# Altium schematic sheet Sheet1.SchDoc
size A4
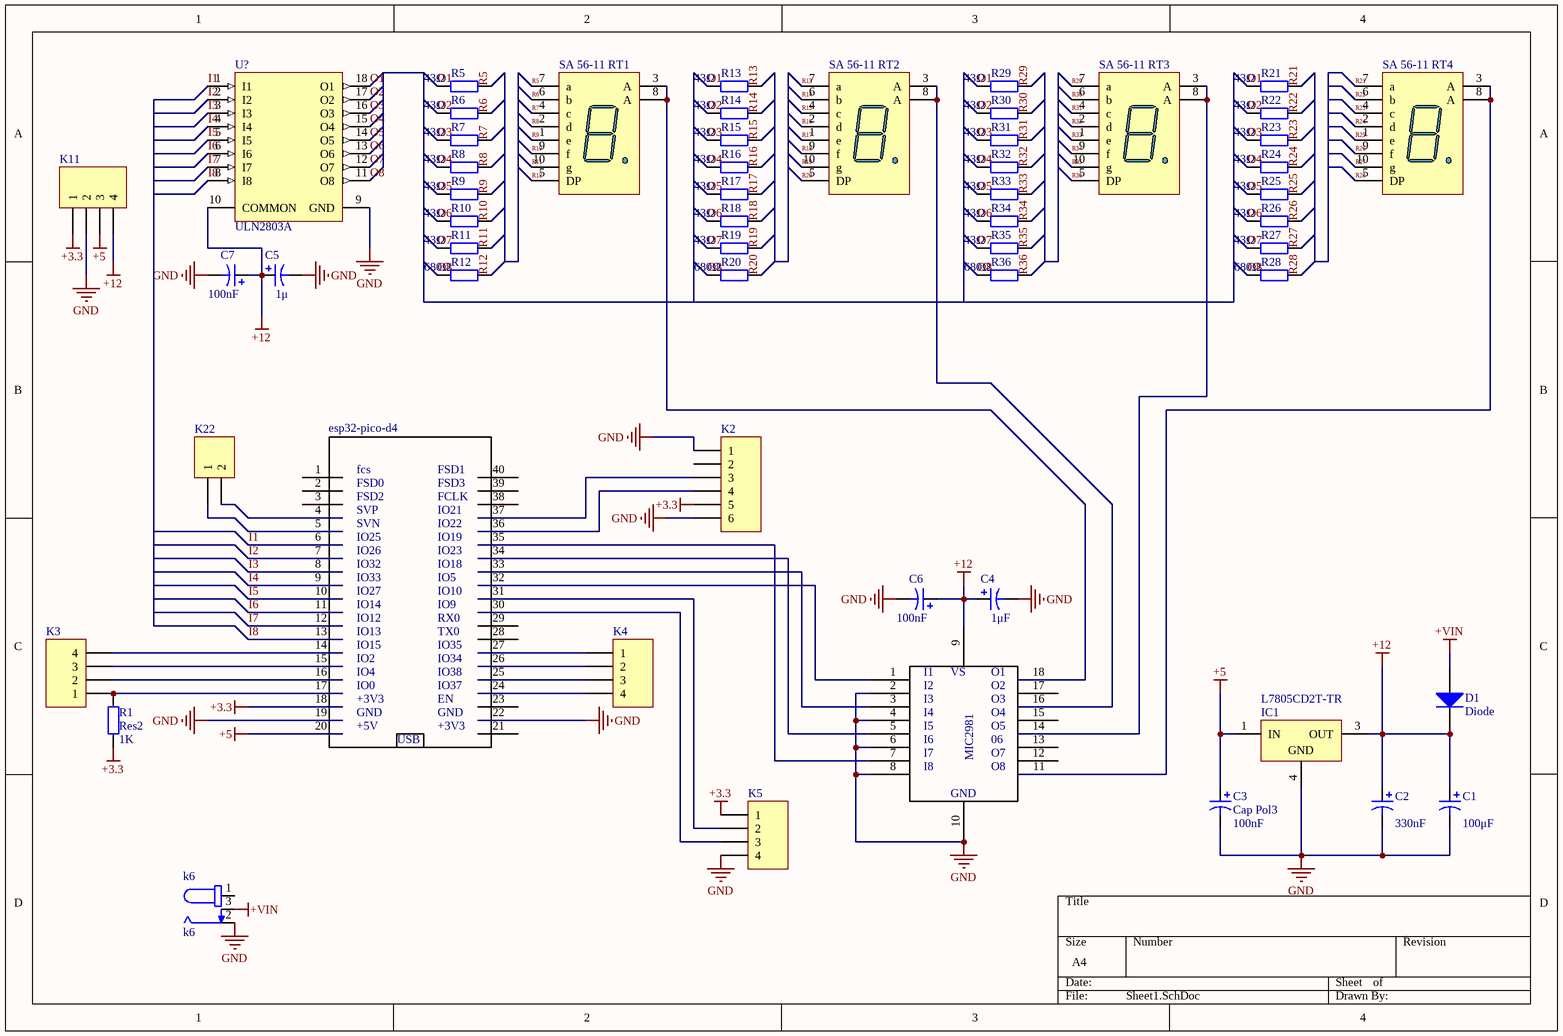
[diagram p0: Sheet1.SchDoc]

## Parts
C1  value 100μF  [CAPR5-4X5]  (hidden comment: Cap Pol1)
C2  value 330nF  [C0805]  (hidden comment: Cap Pol3)
C3  Cap Pol3  value 100nF  [C0805]
C4  value 1μF  [C0805]  (hidden comment: Cap Pol3)
C5  value 1μ  [C0805]  (hidden comment: Cap Pol3)
C6  value 100nF  [C0805]  (hidden comment: Cap Pol3)
C7  value 100nF  [C0805]  (hidden comment: Cap Pol3)
D1  Diode  [DO-41]
esp32-pico-d4  esp32-pico-d4  [esp32picod4]  (value not drawn)
IC1  L7805CD2T-TR  [TO-263_M]
K2  Header 6  [HDR1X6]  (value not drawn)
K3  Header 4  [HDR1X4]  (value not drawn)
K4  Header 4  [HDR1X4]  (value not drawn)
K5  Header 4  [HDR1X4]  (value not drawn)
k6  k6  [k6]
K11  Header 4  [HDR1X4]  (value not drawn)
K22  Header 2  [HDR1X2]  (value not drawn)
mic  MIC2981  [MIC2981]  (value not drawn)
R1  Res2  value 1K  [AXIAL-0.4]
R5  value 43Ω  [smd43]  (hidden comment: Res2)
R6  value 43Ω  [smd43]  (hidden comment: Res2)
R7  value 43Ω  [smd43]  (hidden comment: Res2)
R8  value 43Ω  [smd43]  (hidden comment: Res2)
R9  value 43Ω  [smd43]  (hidden comment: Res2)
R10  value 43Ω  [smd43]  (hidden comment: Res2)
R11  value 43Ω  [smd43]  (hidden comment: Res2)
R12  value 680Ω  [smd43]  (hidden comment: Res2)
R13  value 43Ω  [smd43]  (hidden comment: Res2)
R14  value 43Ω  [smd43]  (hidden comment: Res2)
R15  value 43Ω  [smd43]  (hidden comment: Res2)
R16  value 43Ω  [smd43]  (hidden comment: Res2)
R17  value 43Ω  [smd43]  (hidden comment: Res2)
R18  value 43Ω  [smd43]  (hidden comment: Res2)
R19  value 43Ω  [smd43]  (hidden comment: Res2)
R20  value 680Ω  [smd43]  (hidden comment: Res2)
R21  value 43Ω  [smd43]  (hidden comment: Res2)
R22  value 43Ω  [smd43]  (hidden comment: Res2)
R23  value 43Ω  [smd43]  (hidden comment: Res2)
R24  value 43Ω  [smd43]  (hidden comment: Res2)
R25  value 43Ω  [smd43]  (hidden comment: Res2)
R26  value 43Ω  [smd43]  (hidden comment: Res2)
R27  value 43Ω  [smd43]  (hidden comment: Res2)
R28  value 680Ω  [smd43]  (hidden comment: Res2)
R29  value 43Ω  [smd43]  (hidden comment: Res2)
R30  value 43Ω  [smd43]  (hidden comment: Res2)
R31  value 43Ω  [smd43]  (hidden comment: Res2)
R32  value 43Ω  [smd43]  (hidden comment: Res2)
R33  value 43Ω  [smd43]  (hidden comment: Res2)
R34  value 43Ω  [smd43]  (hidden comment: Res2)
R35  value 43Ω  [smd43]  (hidden comment: Res2)
R36  value 680Ω  [smd43]  (hidden comment: Res2)
SA_56-11_RT1  Dpy Blue-CA  [H]  (value not drawn)
SA_56-11_RT2  Dpy Blue-CA  [H]  (value not drawn)
SA_56-11_RT3  Dpy Blue-CA  [H]  (value not drawn)
SA_56-11_RT4  Dpy Blue-CA  [H]  (value not drawn)
U?  ULN2803A  [STM-DIP-18]

## Nets
+3.3: esp32-pico-d4.18 K2.5 K5.1 K11.1 R1.1
+5: C3.1 esp32-pico-d4.20 IC1.1(IN) K11.3
+12: C1.1 C2.1 C4.1 C5.1 C6.1 C7.1 D1.2(K) IC1.3(OUT) K11.4 U?.10(COMMON)
+VIN: D1.1(A) k6.3
GND: C1.2 C2.2 C3.2 C4.2 C5.2 C6.2 C7.2 esp32-pico-d4.19 esp32-pico-d4.22 IC1.4(GND) K2.1 K2.6 K5.4 k6.2 K11.2 mic.2 mic.4 mic.6 mic.8 mic.10 U?.9(GND)
I1: esp32-pico-d4.6 U?.1(I1)
I2: esp32-pico-d4.7 U?.2(I2)
I3: esp32-pico-d4.8 U?.3(I3)
I4: esp32-pico-d4.9 U?.4(I4)
I5: esp32-pico-d4.10 U?.5(I5)
I6: esp32-pico-d4.11 U?.6(I6)
I7: esp32-pico-d4.12 U?.7(I7)
I8: esp32-pico-d4.13 U?.8(I8)
O1: R5.1 R13.1 R21.1 R29.1 U?.18(O1)
O2: R6.1 R14.1 R22.1 R30.1 U?.17(O2)
O3: R7.1 R15.1 R23.1 R31.1 U?.16(O3)
O4: R8.1 R16.1 R24.1 R32.1 U?.15(O4)
O5: R9.1 R17.1 R25.1 R33.1 U?.14(O5)
O6: R10.1 R18.1 R26.1 R34.1 U?.13(O6)
O7: R11.1 R19.1 R27.1 R35.1 U?.12(O7)
O8: R12.1 R20.1 R28.1 R36.1 U?.11(O8)
R5: R5.2 SA_56-11_RT1.7(a)
R6: R6.2 SA_56-11_RT1.6(b)
R7: R7.2 SA_56-11_RT1.4(c)
R8: R8.2 SA_56-11_RT1.2(d)
R9: R9.2 SA_56-11_RT1.1(e)
R10: R10.2 SA_56-11_RT1.9(f)
R11: R11.2 SA_56-11_RT1.10(g)
R12: R12.2 SA_56-11_RT1.5(DP)
R13: R13.2 SA_56-11_RT2.7(a)
R14: R14.2 SA_56-11_RT2.6(b)
R15: R15.2 SA_56-11_RT2.4(c)
R16: R16.2 SA_56-11_RT2.2(d)
R17: R17.2 SA_56-11_RT2.1(e)
R18: R18.2 SA_56-11_RT2.9(f)
R19: R19.2 SA_56-11_RT2.10(g)
R20: R20.2 SA_56-11_RT2.5(DP)
R21: R21.2 SA_56-11_RT4.7(a)
R22: R22.2 SA_56-11_RT4.6(b)
R23: R23.2 SA_56-11_RT4.4(c)
R24: R24.2 SA_56-11_RT4.2(d)
R25: R25.2 SA_56-11_RT4.1(e)
R26: R26.2 SA_56-11_RT4.9(f)
R27: R27.2 SA_56-11_RT4.10(g)
R28: R28.2 SA_56-11_RT4.5(DP)
R29: R29.2 SA_56-11_RT3.7(a)
R30: R30.2 SA_56-11_RT3.6(b)
R31: R31.2 SA_56-11_RT3.4(c)
R32: R32.2 SA_56-11_RT3.2(d)
R33: R33.2 SA_56-11_RT3.1(e)
R34: R34.2 SA_56-11_RT3.9(f)
R35: R35.2 SA_56-11_RT3.10(g)
R36: R36.2 SA_56-11_RT3.5(DP)
Netesp32-pico-d4_4: esp32-pico-d4.4 K22.2
Netesp32-pico-d4_5: esp32-pico-d4.5 K22.1
Netesp32-pico-d4_14: esp32-pico-d4.14 K3.4
Netesp32-pico-d4_15: esp32-pico-d4.15 K3.3
Netesp32-pico-d4_16: esp32-pico-d4.16 K3.2
Netesp32-pico-d4_17: esp32-pico-d4.17 K3.1 R1.2
Netesp32-pico-d4_24: esp32-pico-d4.24 K4.4
Netesp32-pico-d4_25: esp32-pico-d4.25 K4.3
Netesp32-pico-d4_26: esp32-pico-d4.26 K4.2
Netesp32-pico-d4_27: esp32-pico-d4.27 K4.1
Netesp32-pico-d4_30: esp32-pico-d4.30 K5.3
Netesp32-pico-d4_31: esp32-pico-d4.31 K5.2
Netesp32-pico-d4_32: esp32-pico-d4.32 mic.1
Netesp32-pico-d4_33: esp32-pico-d4.33 mic.3
Netesp32-pico-d4_34: esp32-pico-d4.34 mic.5
Netesp32-pico-d4_35: esp32-pico-d4.35 mic.7
Netesp32-pico-d4_36: esp32-pico-d4.36 K2.4
Netesp32-pico-d4_37: esp32-pico-d4.37 K2.3
Netmic_11: mic.11 SA_56-11_RT4.3(A) SA_56-11_RT4.8(A)
Netmic_14: mic.14 SA_56-11_RT3.3(A) SA_56-11_RT3.8(A)
Netmic_16: mic.16 SA_56-11_RT2.3(A) SA_56-11_RT2.8(A)
Netmic_18: mic.18 SA_56-11_RT1.3(A) SA_56-11_RT1.8(A)

Not connected (* = marked no-connect by the designer): esp32-pico-d4 1 2 3 21 23 28 29 38 39 40; K2 2; k6 1; mic 9 12 13 15 17

## Notes on the sheet
- (in symbol MIC2981) I1; VS; O1; I2; O2; I3; O3; I4; O4; I5; O5; I6; 06; I7; O7; I8; O8; GND
- (in symbol picoESP32-PICO-KIT V) fcs; FSD1; FSD0; FSD3; FSD2; FCLK; SVP; IO21; SVN; IO22; IO25; IO19; IO26; IO23; IO32; IO18; IO33; IO5; IO27; IO10; IO14; IO9; IO12; RX0; IO13; TX0; IO15; IO35; IO2; IO34; IO4; IO38; IO0; IO37; +3V3; EN; GND; +5V; USB

## Library data of the parts
C1 = Cap Pol1: Polarized Capacitor (Radial); Published: 8-Jun-2000; LatestRevisionDate: 17-Jul-2002; LatestRevisionNote: Re-released for DXP Platform.; PackageReference: RB7.6-15; Publisher: Altium Limited; PackageDescription: Polarized Capacitor (Radial); 2 Leads
C2-C7 = Cap Pol3: Polarized Capacitor (Surface Mount); Published: 8-Jun-2000; LatestRevisionDate: 29-May-2009; LatestRevisionNote: IPC-7351 Footprint Added.; PackageReference: C0805; Publisher: Altium Limited; PackageDescription: Chip Capacitor
D1 = Diode 1N4002: 1 Amp General Purpose Rectifier; Published: 8-Jun-2000; LatestRevisionDate: 17-Jul-2002; LatestRevisionNote: Re-released for DXP Platform.; DatasheetVersion: 1998; PackageVersion: Aug-1999; PackageReference: DO-41; Publisher: Altium Limited; PackageDescription: Diode, Axial; Body 5.2 x 2.7 mm (LxDia. max), Lead Dia. 0.86 mm (max); Code_JEDEC: DO-204-AL; ComponentLink1Description: Manufacturer Link; ComponentLink1URL: http://www.fairchildsemi.com/; ComponentLink2Description: Datasheet; ComponentLink2URL: http://www.fairchildsemi.com/ds/1N%2F1N4001.pdf
esp32-pico-d4 = picoESP32-PICO-KIT V
IC1 = CMP-0244-00213-1: Positive Voltage Regulator, 3-Pin D2PAK, Tape and Reel; PackageReference: TO-263; ComponentLink2URL: http://www.st.com/internet/com/TECHNICAL_RESOURCES/TECHNICAL_LITERATURE/DATASHEET/CD00000444.pdf; PackageDescription: 3-Pin Transistor Outline Package 2.54 mm Pitch, 15.4 mm Lead Span (D2PAK); DatasheetVersion: 16/11/2011; ComponentLink2Description: Datasheet; ComponentLink1Description: Manufacturer URL; PackageVersion: 2011; ComponentLink1URL: http://www.st.com
K2 = Header 6: Header, 6-Pin; LatestRevisionDate: 17-Jul-2002; LatestRevisionNote: Re-released for DXP Platform.; Publisher: Altium Limited
K3-K5 K11 = Header 4: Header, 4-Pin; LatestRevisionDate: 17-Jul-2002; LatestRevisionNote: Re-released for DXP Platform.; Publisher: Altium Limited
K22 = Header 2: Header, 2-Pin; LatestRevisionDate: 17-Jul-2002; LatestRevisionNote: Re-released for DXP Platform.; Publisher: Altium Limited
R1 R5-R36 = Res2: Resistor; Published: 8-Jun-2000; LatestRevisionDate: 17-Jul-2002; LatestRevisionNote: Re-released for DXP Platform.; PackageReference: AXIAL-0.4; Publisher: Altium Limited; PackageDescription: Axial Device, Thru-Hole; 2 Leads; 0.4 in Pin Spacing
SA_56-11_RT1-SA_56-11_RT4 = Dpy Blue-CA: 14.2 mm General Purpose Blue 7-Segment Display: CA, RH DP, Gray Surface; MinimumIntensity: 2020 ucd; Note: IF = 10 mA; Published: 8-Jun-2000; LatestRevisionDate: 17-Dec-2003; LatestRevisionNote: Schematic revised, PCB Footprint replaced.; DatasheetVersion: 24-Sep-2002; PackageVersion: 24-Sep-2002; PackageReference: H; Publisher: Altium Limited; PackageDescription: LED, 7-Segment Display, 14.2 mm, RHD; 10 Leads; Row Space 15.24 mm; Pitch 2.54 mm; ComponentLink1Description: Manufacturer Link; ComponentLink1URL: http://www.agilent.com/
  SA_56-11_RT1: Colour: Blue
  SA_56-11_RT2-SA_56-11_RT4: Colour: red
U? = CMP-2000-05363-1: Eight Darlington Arrays, 50 V, 2.25 W, 500 mA, 18-Pin DIP, RoHS, Tube; Manufacturer: STMicroelectronics; DC Collector Current: 500mA; DC Current Gain hFE: 1000hFE; SVHC: NoSVHC(17-Dec-2015); Power Dissipation Pd: 2.25W; Transistor Polarity: NPN; Collector Emitter Voltage V(br)ceo: 50V; No. of Pins: 18Pins; Automotive Qualification Standard: -; Package Reference: DIP-18; Manufacturer URL: http://www.st.com/; MSL: -; Operating Temperature Max: 85degC; Datasheet Version: Sep-03; Transistor Case Style: DIP; Package Description: 18-Pin Double In-line Package, Body 24.8 x 7.1 mm, Pitch 2.54 mm; Product Range: -; Datasheet URL: https://datasheet.ciiva.com/29306/171824-da-01-en-ic-uln2803-dil18-29306026.pdf